# Altium schematic sheet Плата печатная А3.SchDoc
size 420 x 297 mm; Scale: 1:1; Разраб.: Гончаренко В.Ю.; Пров.: Смолин В.А.; Номер листа: 1; Общее количество листов: 5; Децимальный номер: СФ МЭИ КР ПЭ2-18 11.03.04 03; Разработал: Гончаренко В.Ю.; Проверил: Смолин В.А.; Литера: У; Масштаб: 2:1; Лист. Номер: 1
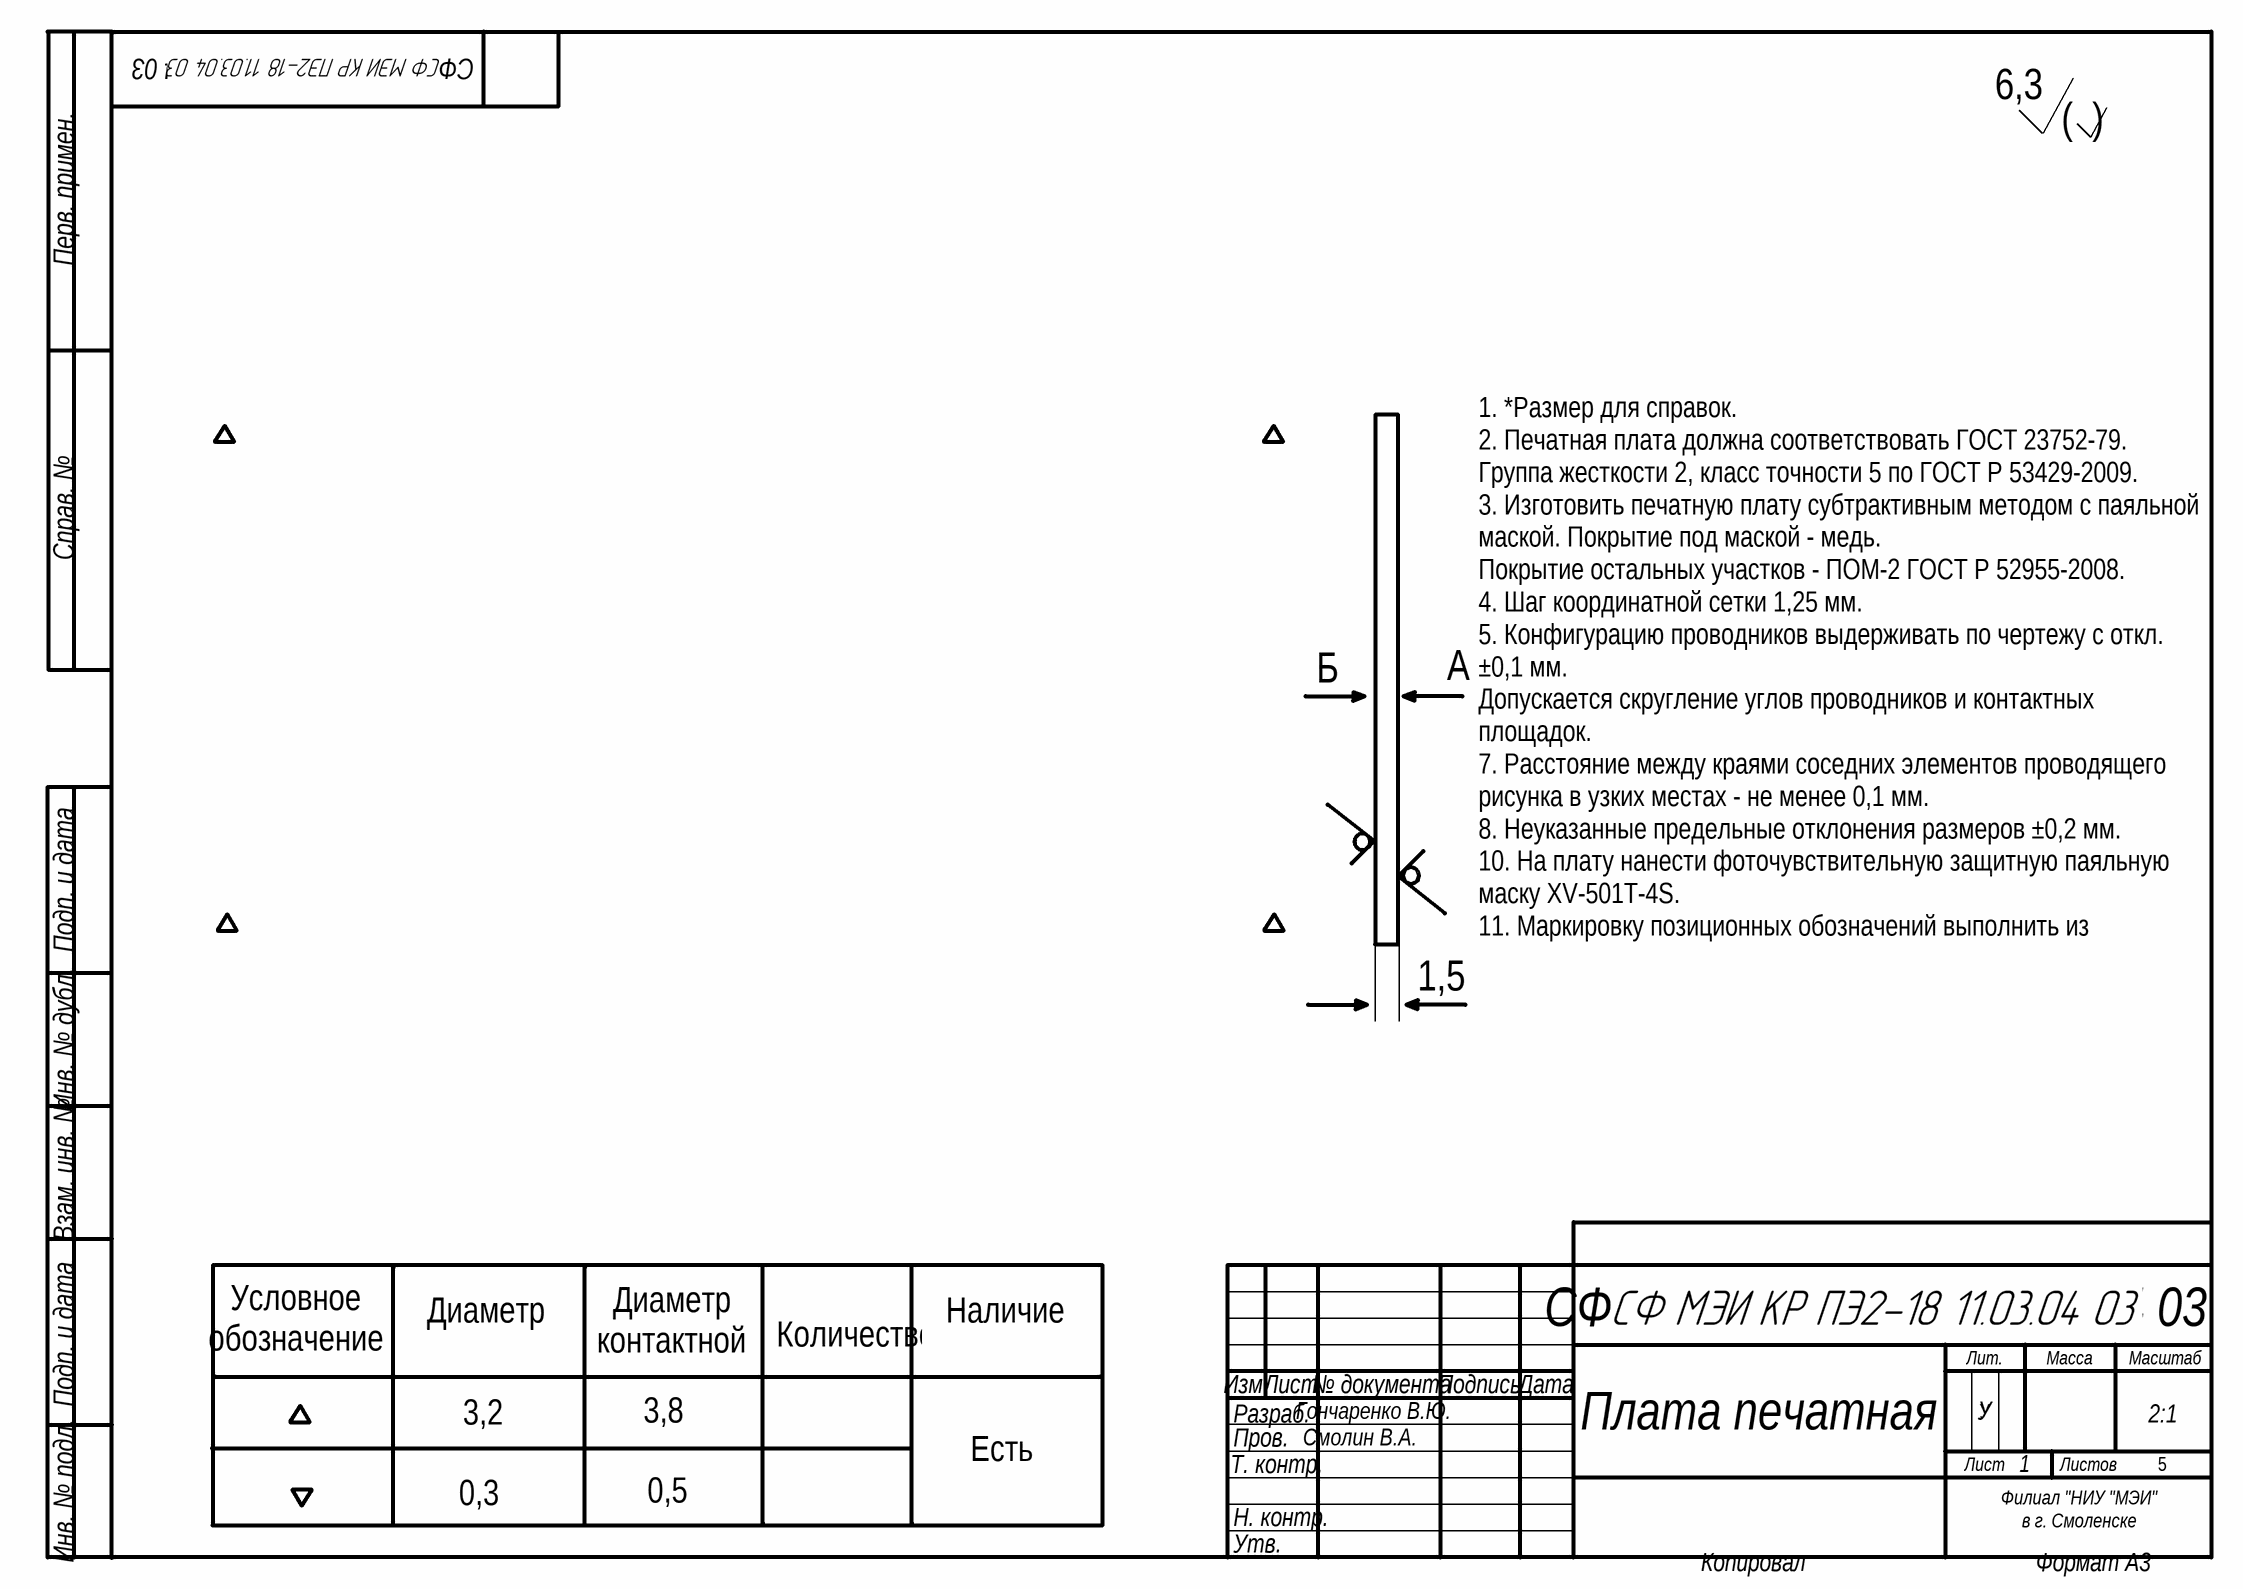
[diagram p0: Плата печатная А3.SchDoc]

## Notes on the sheet
- 6,3
- (  )
- Б
- А
- 1,5
- 1. *Размер для справок.
  2. Печатная плата должна соответствовать ГОСТ 23752-79.
  Группа жесткости 2, класс точности 5 по ГОСТ Р 53429-2009.
  3. Изготовить печатную плату субтрактивным методом с паяльной маской. Покрытие под маской - медь.
  Покрытие остальных участков - ПОМ-2 ГОСТ Р 52955-2008.
  4. Шаг координатной сетки 1,25 мм.
  5. Конфигурацию проводников выдерживать по чертежу с откл. ±0,1 мм.
  Допускается скругление углов проводников и контактных площадок.
  7. Расстояние между краями соседних элементов проводящего рисунка в узких местах - не менее 0,1 мм.
  8. Неуказанные предельные отклонения размеров ±0,2 мм.
  10. На плату нанести фоточувствительную защитную паяльную маску XV-501T-4S.
  11. Маркировку позиционных обозначений выполнить из диэлектрического материала. Шрифт 2-Пр3 ГОСТ 26.020-80.
- Условное
  обозначение
  отверстия
- Диаметр
  отверстия,мм
- Диаметр
  контактной
  площадки,мм
- Количество
- Наличие
  металлизации
- Плата печатная
- 3,2
- 3,8
- 4
- Есть
- 0,3
- 0,5
- 63
- Филиал "НИУ "МЭИ"
  в г. Смоленске
  ПЭ2-18
- Перв. примен.
- Справ. №
- Подп. и дата
- Инв. № дубл.
- Взам. инв. №
- Разраб.
- Изм.
- Лист
- № документа
- Подпись
- Дата
- Лит.
- Масса
- Масштаб
- Т. контр.
- Пров.
- Листов
- Инв. № подл.
- Н. контр.
- Утв.
- Копировал
- Формат A3